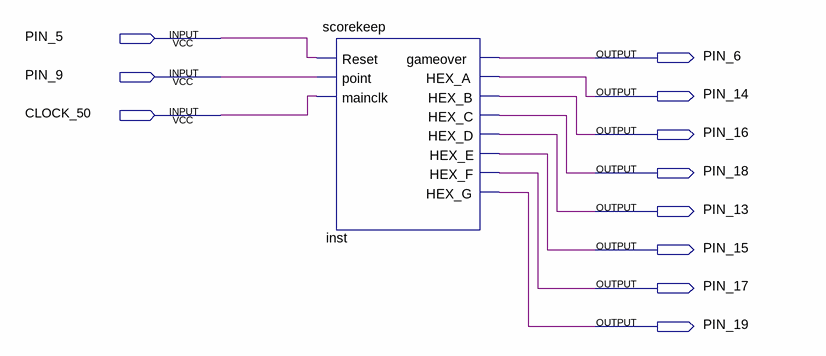
[diagram p0: schematic sheet]
// Quartus schematic scoremachine.bdf as structural Verilog: 1 symbols, 11 pins
module scoremachine (
  input  PIN_5,
  input  PIN_9,
  input  CLOCK_50,
  output PIN_6,
  output PIN_14,
  output PIN_16,
  output PIN_18,
  output PIN_13,
  output PIN_15,
  output PIN_17,
  output PIN_19
);

  scorekeep inst (
    .Reset(PIN_5), .point(PIN_9), .mainclk(CLOCK_50), .gameover(PIN_6), .HEX_A(PIN_14), .HEX_B(PIN_16),
    .HEX_C(PIN_18), .HEX_D(PIN_13), .HEX_E(PIN_15), .HEX_F(PIN_17), .HEX_G(PIN_19));
endmodule
